# Altium schematic sheet PCIe_LB_bridge.SchDoc: PCIe bridge
size 420 x 297 mm; CheckedBy: MC, TW, EB; CompanyName: CERN; DrawnBy: Greg Kasprowicz; Organization: CERN; Address1: European Organization for Nuclear Research; Address2: CH-1211 Geneve 23 - Switzerland; DocumentNumber: 12; Revision: -; SheetNumber: 12; SheetTotal: 17; EDA_Number: EDA-02189-V4-0; Projet: Simple PCIe Carrier Board; ModifiedBy: TW, MC; CreateDate: 10/07/2010; CheckedDate: 11/05/2011; Title2: GN4124; DivGrp: BE-CO; Designer: GK, MC, TW, EB, PAS; ModifiedDate: -
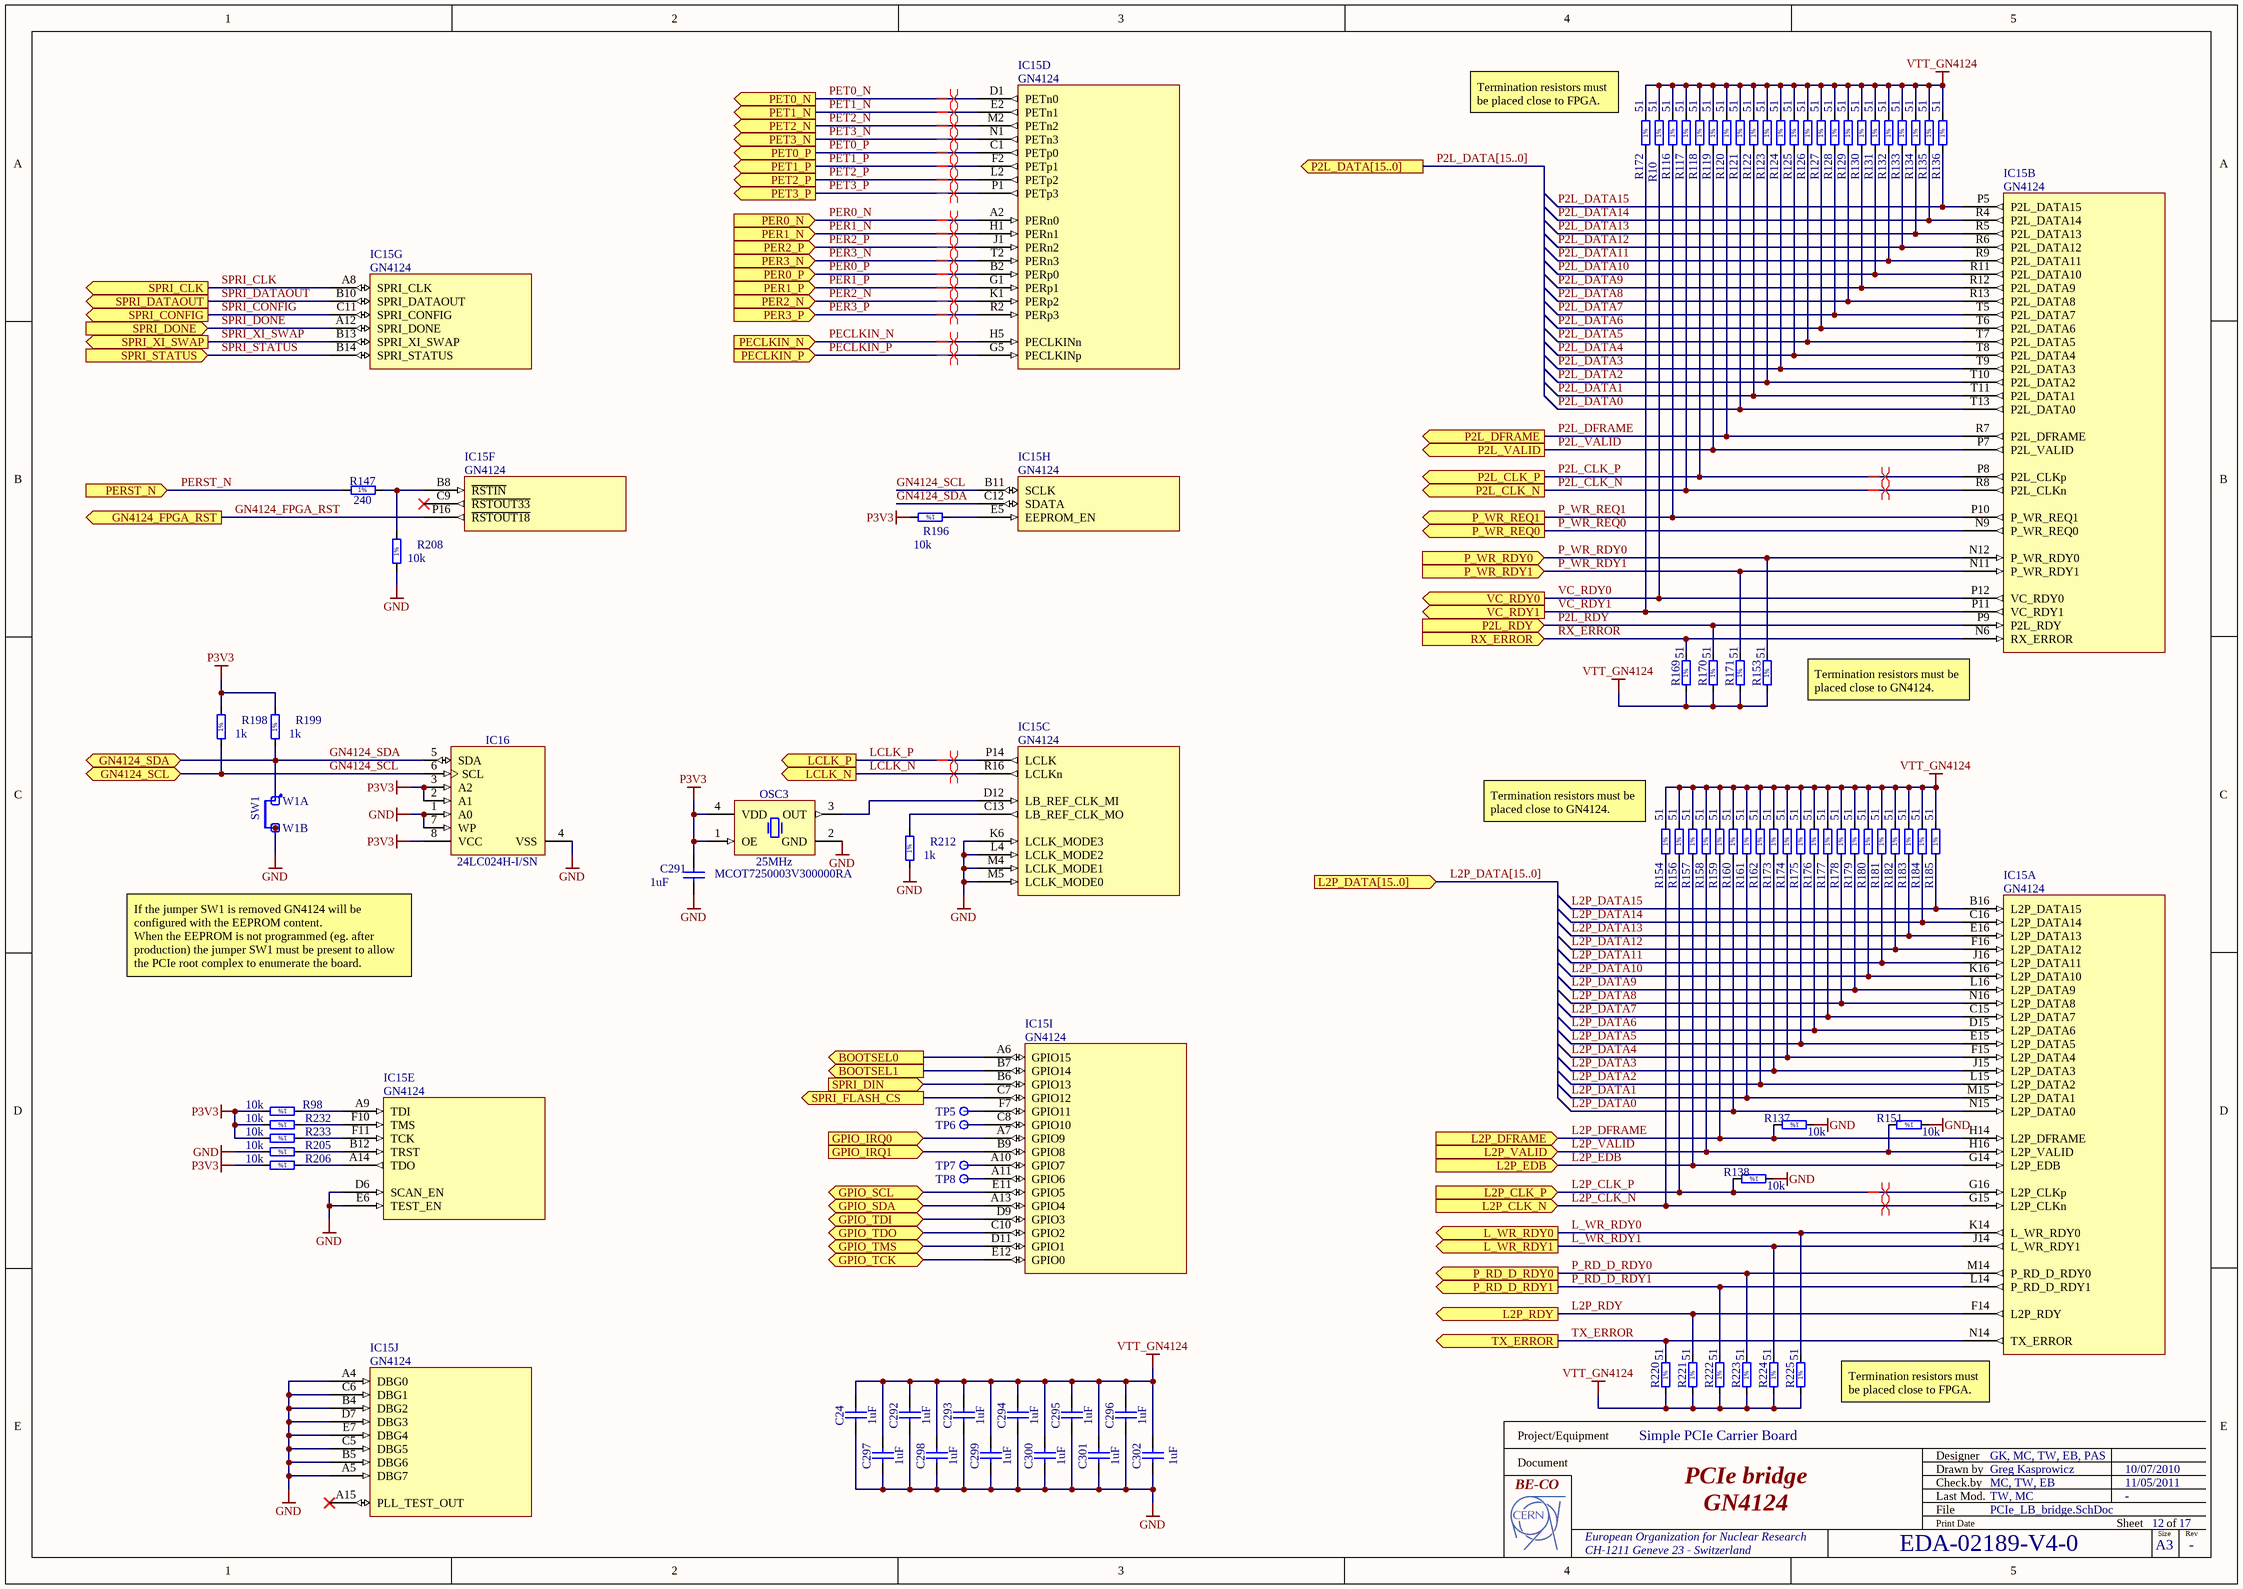
[diagram p0: PCIe_LB_bridge.SchDoc]

## Parts
C24  1uF  [CAPC1608X87N]
C291  1uF  [CAPC1608X87N]
C292  1uF  [CAPC1608X87N]
C293  1uF  [CAPC1608X87N]
C294  1uF  [CAPC1608X87N]
C295  1uF  [CAPC1608X87N]
C296  1uF  [CAPC1608X87N]
C297  1uF  [CAPC1608X87N]
C298  1uF  [CAPC1608X87N]
C299  1uF  [CAPC1608X87N]
C300  1uF  [CAPC1608X87N]
C301  1uF  [CAPC1608X87N]
C302  1uF  [CAPC1608X87N]
IC15  GN4124  [BGA256C100P16X16_1700X1700X150]  (parts A,B,C,D,E,F,G,H,I,J of 11)
IC16  24LC024H-I/SN  [SOIC127P600X175-8N]
OSC3  25MHz  Manufacturer Part Number: MCOT7250003V300000RA  [OSCSC508P500X700X160-4N]
R10  51  [RESC1005X40N]
R98  10k  [RESC1608X55N]
R116  51  [RESC1005X40N]
R117  51  [RESC1005X40N]
R118  51  [RESC1005X40N]
R119  51  [RESC1005X40N]
R120  51  [RESC1005X40N]
R121  51  [RESC1005X40N]
R122  51  [RESC1005X40N]
R123  51  [RESC1005X40N]
R124  51  [RESC1005X40N]
R125  51  [RESC1005X40N]
R126  51  [RESC1005X40N]
R127  51  [RESC1005X40N]
R128  51  [RESC1005X40N]
R129  51  [RESC1005X40N]
R130  51  [RESC1005X40N]
R131  51  [RESC1005X40N]
R132  51  [RESC1005X40N]
R133  51  [RESC1005X40N]
R134  51  [RESC1005X40N]
R135  51  [RESC1005X40N]
R136  51  [RESC1005X40N]
R137  10k  [RESC1608X55N]
R138  10k  [RESC1608X55N]
R147  240  [RESC1608X55N]
R151  10k  [RESC1608X55N]
R153  51  [RESC1005X40N]
R154  51  [RESC1005X40N]
R156  51  [RESC1005X40N]
R157  51  [RESC1005X40N]
R158  51  [RESC1005X40N]
R159  51  [RESC1005X40N]
R160  51  [RESC1005X40N]
R161  51  [RESC1005X40N]
R162  51  [RESC1005X40N]
R169  51  [RESC1005X40N]
R170  51  [RESC1005X40N]
R171  51  [RESC1005X40N]
R172  51  [RESC1005X40N]
R173  51  [RESC1005X40N]
R174  51  [RESC1005X40N]
R175  51  [RESC1005X40N]
R176  51  [RESC1005X40N]
R177  51  [RESC1005X40N]
R178  51  [RESC1005X40N]
R179  51  [RESC1005X40N]
R180  51  [RESC1005X40N]
R181  51  [RESC1005X40N]
R182  51  [RESC1005X40N]
R183  51  [RESC1005X40N]
R184  51  [RESC1005X40N]
R185  51  [RESC1005X40N]
R196  10k  [RESC1608X55N]
R198  1k  [RESC1608X55N]
R199  1k  [RESC1608X55N]
R205  10k  [RESC1608X55N]
R206  10k  [RESC1608X55N]
R208  10k  [RESC1608X55N]
R212  1k  [RESC1608X55N]
R220  51  [RESC1005X40N]
R221  51  [RESC1005X40N]
R222  51  [RESC1005X40N]
R223  51  [RESC1005X40N]
R224  51  [RESC1005X40N]
R225  51  [RESC1005X40N]
R232  10k  [RESC1608X55N]
R233  10k  [RESC1608X55N]
SW1  Jumper Type1  [JUMPER_BLACK_INSULATED_2.54MM]  (value not drawn)
TP5  Test Point  [TPS127]  (value not drawn)
TP6  Test Point  [TPS127]  (value not drawn)
TP7  Test Point  [TPS127]  (value not drawn)
TP8  Test Point  [TPS127]  (value not drawn)
W1  Header 2  [HARWIN_M20-9990246]  (value not drawn)  (parts A,B of 2)

## Ports
BOOTSEL0 (out), BOOTSEL1 (out), GN4124_FPGA_RST (out), GN4124_SCL (bidir), GN4124_SDA (bidir), GPIO_IRQ0 (in), GPIO_IRQ1 (in), GPIO_SCL (bidir), GPIO_SDA (bidir), GPIO_TCK (bidir), GPIO_TDI (bidir), GPIO_TDO (bidir), GPIO_TMS (bidir), L2P_CLK_N (in), L2P_CLK_P (in), L2P_DATA[15..0] (in), L2P_DFRAME (in), L2P_EDB (in), L2P_RDY (out), L2P_VALID (in), L_WR_RDY0 (out), L_WR_RDY1 (out), LCLK_N (out), LCLK_P (out), P2L_CLK_N (out), P2L_CLK_P (out), P2L_DATA[15..0] (out), P2L_DFRAME (out), P2L_RDY (in), P2L_VALID (out), P_RD_D_RDY0 (out), P_RD_D_RDY1 (out), P_WR_RDY0 (in), P_WR_RDY1 (in), P_WR_REQ0 (out), P_WR_REQ1 (out), PECLKIN_N (in), PECLKIN_P (in), PER0_N (in), PER0_P (in), PER1_N (in), PER1_P (in), PER2_N (in), PER2_P (in), PER3_N (in), PER3_P (in), PERST_N (in), PET0_N (out), PET0_P (out), PET1_N (out), PET1_P (out), PET2_N (out), PET2_P (out), PET3_N (out), PET3_P (out), RX_ERROR (in), SPRI_CLK (out), SPRI_CONFIG (out), SPRI_DATAOUT (out), SPRI_DIN (in), SPRI_DONE (in), SPRI_FLASH_CS (out), SPRI_STATUS (in), SPRI_XI_SWAP (out), TX_ERROR (out), VC_RDY0 (out), VC_RDY1 (out)

## Nets
GND: C24.1 C291.1 C292.1 C293.1 C294.1 C295.1 C296.1 C297.1 C298.1 C299.1 C300.1 C301.1 C302.1 IC15.A4(DBG0) IC15.A5(DBG7) IC15.B4(DBG2) IC15.B5(DBG6) IC15.C5(DBG5) IC15.C6(DBG1) IC15.D6(SCAN_EN) IC15.D7(DBG3) IC15.E6(TEST_EN) IC15.E7(DBG4) IC15.K6(LCLK_MODE3) IC15.L4(LCLK_MODE2) IC15.M4(LCLK_MODE1) IC15.M5(LCLK_MODE0) IC16.1(A0) IC16.4(VSS) IC16.7(WP) OSC3.2(GND) R137.1 R138.1 R151.1 R205.2 R208.1 R212.1 SW1.1 W1.2
P3V3: C291.2 IC16.2(A1) IC16.3(A2) IC16.8(VCC) OSC3.1(OE) OSC3.4(VDD) R98.2 R196.2 R198.2 R199.2 R206.2 R232.2 R233.2
VTT_GN4124: C24.2 C292.2 C293.2 C294.2 C295.2 C296.2 C297.2 C298.2 C299.2 C300.2 C301.2 C302.2 R10.2 R116.2 R117.2 R118.2 R119.2 R120.2 R121.2 R122.2 R123.2 R124.2 R125.2 R126.2 R127.2 R128.2 R129.2 R130.2 R131.2 R132.2 R133.2 R134.2 R135.2 R136.2 R153.1 R154.2 R156.2 R157.2 R158.2 R159.2 R160.2 R161.2 R162.2 R169.1 R170.1 R171.1 R172.2 R173.2 R174.2 R175.2 R176.2 R177.2 R178.2 R179.2 R180.2 R181.2 R182.2 R183.2 R184.2 R185.2 R220.1 R221.1 R222.1 R223.1 R224.1 R225.1
BOOTSEL0: IC15.A6(GPIO15) ; port BOOTSEL0
BOOTSEL1: IC15.B7(GPIO14) ; port BOOTSEL1
GN4124_FPGA_RST: IC15.P16(~{RSTOUT18}) ; port GN4124_FPGA_RST
GN4124_SCL: IC15.B11(SCLK) IC16.6(SCL) R198.1 ; port GN4124_SCL
GN4124_SDA: IC15.C12(SDATA) IC16.5(SDA) R199.1 W1.1 ; port GN4124_SDA
GPIO_IRQ0: IC15.A7(GPIO9) ; port GPIO_IRQ0
GPIO_IRQ1: IC15.B9(GPIO8) ; port GPIO_IRQ1
GPIO_SCL: IC15.E11(GPIO5) ; port GPIO_SCL
GPIO_SDA: IC15.A13(GPIO4) ; port GPIO_SDA
GPIO_TCK: IC15.E12(GPIO0) ; port GPIO_TCK
GPIO_TDI: IC15.D9(GPIO3) ; port GPIO_TDI
GPIO_TDO: IC15.C10(GPIO2) ; port GPIO_TDO
GPIO_TMS: IC15.D11(GPIO1) ; port GPIO_TMS
L2P_CLK_N: IC15.G15(L2P_CLKn) R154.1 ; port L2P_CLK_N
L2P_CLK_P: IC15.G16(L2P_CLKp) R138.2 R156.1 ; port L2P_CLK_P
L2P_DATA0: IC15.N15(L2P_DATA0) R160.1
L2P_DATA1: IC15.M15(L2P_DATA1) R161.1
L2P_DATA2: IC15.L15(L2P_DATA2) R162.1
L2P_DATA3: IC15.J15(L2P_DATA3) R173.1
L2P_DATA4: IC15.F15(L2P_DATA4) R174.1
L2P_DATA5: IC15.E15(L2P_DATA5) R175.1
L2P_DATA6: IC15.D15(L2P_DATA6) R176.1
L2P_DATA7: IC15.C15(L2P_DATA7) R177.1
L2P_DATA8: IC15.N16(L2P_DATA8) R178.1
L2P_DATA9: IC15.L16(L2P_DATA9) R179.1
L2P_DATA10: IC15.K16(L2P_DATA10) R180.1
L2P_DATA11: IC15.J16(L2P_DATA11) R181.1
L2P_DATA12: IC15.F16(L2P_DATA12) R182.1
L2P_DATA13: IC15.E16(L2P_DATA13) R183.1
L2P_DATA14: IC15.C16(L2P_DATA14) R184.1
L2P_DATA15: IC15.B16(L2P_DATA15) R185.1
L2P_DFRAME: IC15.H14(L2P_DFRAME) R137.2 R159.1 ; port L2P_DFRAME
L2P_EDB: IC15.G14(L2P_EDB) R157.1 ; port L2P_EDB
L2P_RDY: IC15.F14(L2P_RDY) R221.2 ; port L2P_RDY
L2P_VALID: IC15.H16(L2P_VALID) R151.2 R158.1 ; port L2P_VALID
L_WR_RDY0: IC15.K14(L_WR_RDY0) R225.2 ; port L_WR_RDY0
L_WR_RDY1: IC15.J14(L_WR_RDY1) R224.2 ; port L_WR_RDY1
LCLK_N: IC15.R16(LCLKn) ; port LCLK_N
LCLK_P: IC15.P14(LCLK) ; port LCLK_P
P2L_CLK_N: IC15.R8(P2L_CLKn) R117.1 ; port P2L_CLK_N
P2L_CLK_P: IC15.P8(P2L_CLKp) R118.1 ; port P2L_CLK_P
P2L_DATA0: IC15.T13(P2L_DATA0) R121.1
P2L_DATA1: IC15.T11(P2L_DATA1) R122.1
P2L_DATA2: IC15.T10(P2L_DATA2) R123.1
P2L_DATA3: IC15.T9(P2L_DATA3) R124.1
P2L_DATA4: IC15.T8(P2L_DATA4) R125.1
P2L_DATA5: IC15.T7(P2L_DATA5) R126.1
P2L_DATA6: IC15.T6(P2L_DATA6) R127.1
P2L_DATA7: IC15.T5(P2L_DATA7) R128.1
P2L_DATA8: IC15.R13(P2L_DATA8) R129.1
P2L_DATA9: IC15.R12(P2L_DATA9) R130.1
P2L_DATA10: IC15.R11(P2L_DATA10) R131.1
P2L_DATA11: IC15.R9(P2L_DATA11) R132.1
P2L_DATA12: IC15.R6(P2L_DATA12) R133.1
P2L_DATA13: IC15.R5(P2L_DATA13) R134.1
P2L_DATA14: IC15.R4(P2L_DATA14) R135.1
P2L_DATA15: IC15.P5(P2L_DATA15) R136.1
P2L_DFRAME: IC15.R7(P2L_DFRAME) R120.1 ; port P2L_DFRAME
P2L_RDY: IC15.P9(P2L_RDY) R170.2 ; port P2L_RDY
P2L_VALID: IC15.P7(P2L_VALID) R119.1 ; port P2L_VALID
P_RD_D_RDY0: IC15.M14(P_RD_D_RDY0) R223.2 ; port P_RD_D_RDY0
P_RD_D_RDY1: IC15.L14(P_RD_D_RDY1) R222.2 ; port P_RD_D_RDY1
P_WR_RDY0: IC15.N12(P_WR_RDY0) R153.2 ; port P_WR_RDY0
P_WR_RDY1: IC15.N11(P_WR_RDY1) R171.2 ; port P_WR_RDY1
P_WR_REQ0: IC15.N9(P_WR_REQ0) ; port P_WR_REQ0
P_WR_REQ1: IC15.P10(P_WR_REQ1) R116.1 ; port P_WR_REQ1
PECLKIN_N: IC15.H5(PECLKINn) ; port PECLKIN_N
PECLKIN_P: IC15.G5(PECLKINp) ; port PECLKIN_P
PER0_N: IC15.A2(PERn0) ; port PER0_N
PER0_P: IC15.B2(PERp0) ; port PER0_P
PER1_N: IC15.H1(PERn1) ; port PER1_N
PER1_P: IC15.G1(PERp1) ; port PER1_P
PER2_N: IC15.K1(PERp2) ; port PER2_N
PER2_P: IC15.J1(PERn2) ; port PER2_P
PER3_N: IC15.T2(PERn3) ; port PER3_N
PER3_P: IC15.R2(PERp3) ; port PER3_P
PERST_N: R147.1 ; port PERST_N
PET0_N: IC15.D1(PETn0) ; port PET0_N
PET0_P: IC15.C1(PETp0) ; port PET0_P
PET1_N: IC15.E2(PETn1) ; port PET1_N
PET1_P: IC15.F2(PETp1) ; port PET1_P
PET2_N: IC15.M2(PETn2) ; port PET2_N
PET2_P: IC15.L2(PETp2) ; port PET2_P
PET3_N: IC15.N1(PETn3) ; port PET3_N
PET3_P: IC15.P1(PETp3) ; port PET3_P
RX_ERROR: IC15.N6(RX_ERROR) R169.2 ; port RX_ERROR
SPRI_CLK: IC15.A8(SPRI_CLK) ; port SPRI_CLK
SPRI_CONFIG: IC15.C11(SPRI_CONFIG) ; port SPRI_CONFIG
SPRI_DATAOUT: IC15.B10(SPRI_DATAOUT) ; port SPRI_DATAOUT
SPRI_DIN: IC15.B6(GPIO13) ; port SPRI_DIN
SPRI_DONE: IC15.A12(SPRI_DONE) ; port SPRI_DONE
SPRI_FLASH_CS: IC15.C7(GPIO12) ; port SPRI_FLASH_CS
SPRI_STATUS: IC15.B14(SPRI_STATUS) ; port SPRI_STATUS
SPRI_XI_SWAP: IC15.B13(SPRI_XI_SWAP) ; port SPRI_XI_SWAP
TX_ERROR: IC15.N14(TX_ERROR) R220.2 ; port TX_ERROR
VC_RDY0: IC15.P12(VC_RDY0) R10.1 ; port VC_RDY0
VC_RDY1: IC15.P11(VC_RDY1) R172.1 ; port VC_RDY1
NetIC15_A9: IC15.A9(TDI) R98.1
NetIC15_A10: IC15.A10(GPIO7) TP7.1
NetIC15_A11: IC15.A11(GPIO6) TP8.1
NetIC15_A14: IC15.A14(TDO) R206.1
NetIC15_B8: IC15.B8(~{RSTIN}) R147.2 R208.2
NetIC15_B12: IC15.B12(TRST) R205.1
NetIC15_C8: IC15.C8(GPIO10) TP6.1
NetIC15_C13: IC15.C13(LB_REF_CLK_MO) R212.2
NetIC15_D12: IC15.D12(LB_REF_CLK_MI) OSC3.3(OUT)
NetIC15_E5: IC15.E5(EEPROM_EN) R196.1
NetIC15_F7: IC15.F7(GPIO11) TP5.1
NetIC15_F10: IC15.F10(TMS) R232.1
NetIC15_F11: IC15.F11(TCK) R233.1

Not connected (* = marked no-connect by the designer): IC15 A15(PLL_TEST_OUT)* C9(~{RSTOUT33})*

## Buses and harness runs
bus L2P_DATA[15..0] = port L2P_DATA[15..0]
bus P2L_DATA[15..0] = port P2L_DATA[15..0]

## Layout directives
differential pair: L2P_CLK_N, L2P_CLK_P, LCLK_N, LCLK_P, P2L_CLK_N, P2L_CLK_P, PECLKIN_N, PECLKIN_P, PER0_N, PER0_P, PER1_N, PER1_P, PER2_N, PER2_P, PER3_N, PER3_P, PET0_N, PET0_P, PET1_N, PET1_P, PET2_N, PET2_P, PET3_N, PET3_P

## Notes on the sheet
- Termination resistors must be placed close to FPGA.
- Termination resistors must be placed close to GN4124.
- If the jumper SW1 is removed GN4124 will be configured with the EEPROM content.
  When the EEPROM is not programmed (eg. after production) the jumper SW1 must be present to allow the PCIe root complex to enumerate the board.
- Project/Equipment
- Document
- Designer
- Drawn by
- Check.by
- File
- Last Mod.
- Print Date
- Sheet
- Size
- A3
- of
- Rev
- (in symbol R0402_51R_1%_0.0625W_100PPM) 1%
- (in symbol R0603_1K_1%_0.1W_100PPM) 1%
- (in symbol R0603_10K_1%_0.1W_100PPM) 1%
- (in symbol R0603_240R_1%_0.1W_100PPM) 1%

## Library data of the parts
C24 C291-C302 = CC0603_1UF_16V_10%_X7R: Non-polarised capacitor; Part Description: SMD Multilayer Chip Ceramic Capacitor; Manufacturer: GENERIC; Manufacturer1 Part Number: 223824613663; Voltage: 16V; TC: X7R; Tolerance: ±10%; Table: Capacitors SMD; Part Number: CC0603_1UF_16V_10%_X7R; Component Kind: Standard; Component Type: Standard; Pin Count: 2; Value: 1uF; Status: Preferred; Manufacturer Part Number: CC0603_1uF_16V_10%_X7R; Case: 0603; Mounted: Yes; Socket: No; SMD: Yes; Manufacturer1 Example: PHYCOMP; Manufacturer1 ComponentHeight: 0.87mm; HelpURL: \\cern.ch\dfs\Applications\Altium\Datasheets\CC0805_X5R_PHYCOMP_HC.pdf; Author: CERN DEM JLC; CreateDate: 12/3/2007; LatestRevisionDate: 12/3/2007
IC15 = GN4124: x4 Lane PCI Express to Local Bridge; Manufacturer: GENNUM; Table: Logic; Part Number: GN4124; Component Kind: Standard; Component Type: Standard; Device: GN4124; PackageDescription: BGA 1mm, Pitch, Square 256 Pin, 16 Columns x 16 Rows, Body 17mm X 17mm X 1.50mm H; Part Description: x4 Lane PCI Express to Local Bridge; Manufacturer Part Number: GN4124; Pin Count: 256; Case: BGA256; Mounted: Yes; Socket: No; SMD: Yes; ComponentHeight: 1.5mm; HelpURL: \\cern.ch\dfs\Applications\Altium\Datasheets\GN4124.pdf; Author: CERN DEM JLC; CreateDate: 02/12/2009; LatestRevisionDate: 13/04/2011
IC16 = 24LC024H-I/SN: 2K I2C Serial EEPROM With Half-Array Write Protect; Part Description: 2.5V-5.5V, 2K (256 x 8-bit) I2C Serial EEPROM With Half-Array Write Protect; Manufacturer: MICROCHIP TECHNOLOGY; Table: Logic; Part Number: 24LC024H-I/SN; Component Kind: Standard; Component Type: Standard; Device: 24LC024H-I/SN; PackageDescription: SOIC 8, Pitch 1.27mm - Body 4x5mm, IPC Medium Density; Manufacturer Part Number: 24LC024H-I/SN; Pin Count: 8; Case: SOIC8; Mounted: Yes; Socket: No; SMD: Yes; ComponentHeight: 1.75mm; HelpURL: \\cern.ch\dfs\Applications\Altium\Datasheets\24LC024H-I-SN.pdf; Author: CERN DEM JLC; CreateDate: 1/24/2011; LatestRevisionDate: 1/24/2011
OSC3 = OSC_25MHZ_MULTICOMP_MCOT7250003V300000RA: Oscillator 4 pins 1=OE 2=GND 3=OUT 4=VDD; Part Description: 3V3 ±100ppm 50pF  Tri-State Surface Mount MOS Clock Oscillator (OT7 Serie); Table: Crystals & Oscillators; Part Number: OSC_25MHZ_MULTICOMP_MCOT7250003V300000RA; Component Kind: Standard; Component Type: Standard; PackageDescription: SMD Oscillator, side convave, 4 pins, 5.00x7.00mm; Value: 25MHz; Manufacturer: MULTICOMP; Pin Count: 4; Mounted: Yes; Socket: No; SMD: Yes; ComponentHeight: 2mm; HelpURL: \\cern.ch\dfs\Applications\Altium\Datasheets\OSC_MULTICOMP_MCOT7.pdf; Author: CERN DEM JLC; CreateDate: 07/12/2010; LatestRevisionDate: 07/12/2010
R10 R116-R136 R153 R154 R156-R162 R169-R185 R220-R225 = R0402_51R_1%_0.0625W_100PPM: Resistor - 1%; Part Description: General Purpose Thick Film Chip Resistor; Manufacturer: GENERIC; Manufacturer1 Part Number: 232270675109; TC: ±100ppm/°C; Table: Resistors SMD; Part Number: R0402_51R_1%_0.0625W_100PPM; Component Kind: Standard; Component Type: Standard; Pin Count: 2; Value: 51; Status: Not recommended; Power: 0.0625W; Tolerance: ±1%; Manufacturer Part Number: R0402_51R_1%_0.0625W_100PPM; Case: 0402; Mounted: Yes; Socket: No; SMD: Yes; Manufacturer1 Example: PHYCOMP; Manufacturer1 ComponentHeight: 0.4mm; HelpURL: \\cern.ch\dfs\Applications\Altium\Datasheets\R0402_Phycomp_RC0402.pdf; Author: CERN DEM JLC; CreateDate: 03/12/2007; LatestRevisionDate: 13/03/2008
R98 R137 R138 R151 R196 R205 R206 R208 R232 R233 = R0603_10K_1%_0.1W_100PPM: Resistor - 1%; Part Description: General Purpose Thick Film Chip Resistor; Manufacturer: GENERIC; Manufacturer1 Part Number: NRC06F1002TRF; Power: 0.1W; TC: ±100ppm/°C; Table: Resistors SMD; Part Number: R0603_10K_1%_0.1W_100PPM; Component Kind: Standard; Component Type: Standard; Pin Count: 2; Value: 10k; Status: Preferred; Tolerance: ±1%; Manufacturer Part Number: R0603_10K_1%_0.1W_100PPM; Case: 0603; Mounted: Yes; Socket: No; SMD: Yes; Manufacturer1 Example: NIC COMPONENT; Manufacturer1 ComponentHeight: 0.55mm; HelpURL: \\cern.ch\dfs\Applications\Altium\Datasheets\R0603_NIC_NRC.pdf; Author: CERN DEM JLC; CreateDate: 12/3/2007; LatestRevisionDate: 3/13/2008
R147 = R0603_240R_1%_0.1W_100PPM: Resistor - 1%; Part Description: General Purpose Thick Film Chip Resistor; Manufacturer: GENERIC; Manufacturer1 Part Number: NRC06F2400TRF; Power: 0.1W; TC: ±100ppm/°C; Table: Resistors SMD; Part Number: R0603_240R_1%_0.1W_100PPM; Component Kind: Standard; Component Type: Standard; Pin Count: 2; Value: 240; Status: Preferred; Tolerance: ±1%; Manufacturer Part Number: R0603_240R_1%_0.1W_100PPM; Case: 0603; Mounted: Yes; Socket: No; SMD: Yes; Manufacturer1 Example: NIC COMPONENT; Manufacturer1 ComponentHeight: 0.55mm; HelpURL: \\cern.ch\dfs\Applications\Altium\Datasheets\R0603_NIC_NRC.pdf; Author: CERN DEM JLC; CreateDate: 12/3/2007; LatestRevisionDate: 3/13/2008
R198 R199 R212 = R0603_1K_1%_0.1W_100PPM: Resistor - 1%; Part Description: General Purpose Thick Film Chip Resistor; Manufacturer: GENERIC; Manufacturer1 Part Number: NRC06F1001TRF; Power: 0.1W; TC: ±100ppm/°C; Table: Resistors SMD; Part Number: R0603_1K_1%_0.1W_100PPM; Component Kind: Standard; Component Type: Standard; Pin Count: 2; Value: 1k; Status: Preferred; Tolerance: ±1%; Manufacturer Part Number: R0603_1K_1%_0.1W_100PPM; Case: 0603; Mounted: Yes; Socket: No; SMD: Yes; Manufacturer1 Example: NIC COMPONENT; Manufacturer1 ComponentHeight: 0.55mm; HelpURL: \\cern.ch\dfs\Applications\Altium\Datasheets\R0603_NIC_NRC.pdf; Author: CERN DEM JLC
  R198 R199: CreateDate: 12/3/2007; LatestRevisionDate: 3/13/2008
  R212: CreateDate: 03/12/2007; LatestRevisionDate: 13/03/2008
SW1 = COMATEL_313.1730.0.00.40.0: Jumper 1 Pin; Part Description: Closed Insulated Black Jumper Pitch 2.54mm; Manufacturer: KONTEK COMATEL; SCEM: 09.55.10.960.9; Part Number: COMATEL_313.1730.0.00.40.0; Component Kind: Standard; Component Type: Standard; Pin Count: 1; Family: Jumper; Mounted: Yes; Socket: No; SMD: No; Status: None; Manufacturer Part Number: 313.1730.0.00.40.0; ComponentHeight: 6.5mm; HelpURL: \\cern.ch\dfs\Applications\Altium\Datasheets\COMATEL_313.1730.0.00.40.0.pdf; Author: CERN DEM JLC; CreateDate: 4/9/2008; LatestRevisionDate: 6/30/2010; Table: COMATEL
TP5-TP8 = SMD_PAD_1.27X1.27MM: Part Description: 1.27mm x 1.27mm PCB Copper Area (SMD Test Point); Mounted: No; Table: Pads; Part Number: SMD_PAD_1.27X1.27MM; Component Kind: Standard (No BOM); Component Type: Standard (No BOM); Pin Count: 1; Family: Test Point; Socket: No; SMD: Yes; Status: None; ComponentHeight: 0mm; Author: CERN DEM JLC; CreateDate: 12/01/2008; LatestRevisionDate: 12/01/2008; PackageDescription: 1.27mm x 1.27mm PCB Copper Area (SMD Test Point)
W1 = HARWIN_M20-9990246: 2 Mini Wire-Wrap Contact Strip Header; Part Description: 2 Contacts SIL Vertical Pin Header, Pitch 2.54mm, Mating Height 6.1mm, Insulator 2.54mm; Manufacturer: HARWIN; Part Number: HARWIN_M20-9990246; Component Kind: Standard; Component Type: Standard; Pin Count: 2; Family: Header 2; Mounted: Yes; Socket: No; SMD: No; Status: None; Manufacturer Part Number: M20-9990246; ComponentHeight: 8.68mm; HelpURL: \\cern.ch\dfs\Applications\Altium\Datasheets\HARWIN_M20-9990246.pdf; Author: CERN DEM JLC; CreateDate: 6/1/2011; LatestRevisionDate: 6/1/2011; Table: HARWIN